# Altium schematic sheet SH04-DSP.SchDoc
size A4
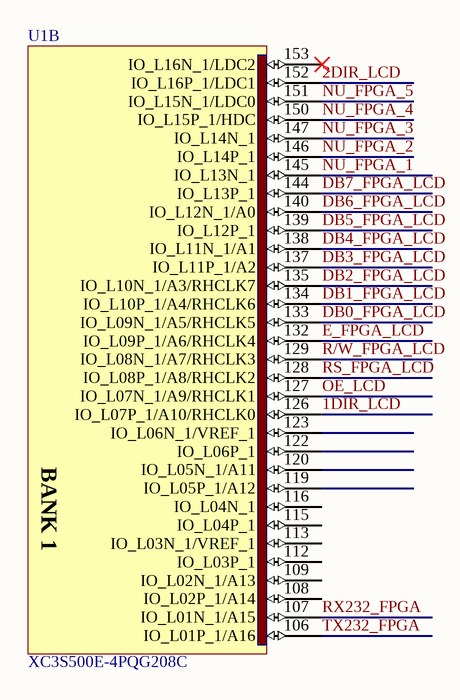
[diagram p0: SH04-DSP.SchDoc]

## Parts
U1  XC3S500E-4PQG208C  [PQG208_N]  (part B of 8)

## Nets
1DIR_LCD: U1.126(IO_L07P_1/A10/RHCLK0)
2DIR_LCD: U1.152(IO_L16P_1/LDC1)
DB0_FPGA_LCD: U1.133(IO_L09N_1/A5/RHCLK5)
DB1_FPGA_LCD: U1.134(IO_L10P_1/A4/RHCLK6)
DB2_FPGA_LCD: U1.135(IO_L10N_1/A3/RHCLK7)
DB3_FPGA_LCD: U1.137(IO_L11P_1/A2)
DB4_FPGA_LCD: U1.138(IO_L11N_1/A1)
DB5_FPGA_LCD: U1.139(IO_L12P_1)
DB6_FPGA_LCD: U1.140(IO_L12N_1/A0)
DB7_FPGA_LCD: U1.144(IO_L13P_1)
E_FPGA_LCD: U1.132(IO_L09P_1/A6/RHCLK4)
NU_FPGA_1: U1.145(IO_L13N_1)
NU_FPGA_2: U1.146(IO_L14P_1)
NU_FPGA_3: U1.147(IO_L14N_1)
NU_FPGA_4: U1.150(IO_L15P_1/HDC)
NU_FPGA_5: U1.151(IO_L15N_1/LDC0)
~{OE}_LCD: U1.127(IO_L07N_1/A9/RHCLK1)
R/W_FPGA_LCD: U1.129(IO_L08N_1/A7/RHCLK3)
RS_FPGA_LCD: U1.128(IO_L08P_1/A8/RHCLK2)
RX232_FPGA: U1.107(IO_L01N_1/A15)
TX232_FPGA: U1.106(IO_L01P_1/A16)

Not connected (* = marked no-connect by the designer): U1 108(IO_L02P_1/A14) 109(IO_L02N_1/A13) 112(IO_L03P_1) 113(IO_L03N_1/VREF_1) 115(IO_L04P_1) 116(IO_L04N_1) 119(IO_L05P_1/A12) 120(IO_L05N_1/A11) 122(IO_L06P_1) 123(IO_L06N_1/VREF_1) 153(IO_L16N_1/LDC2)*

## Notes on the sheet
- (in symbol XC3S500E-4PQG208C, part B) BANK 1

## Library data of the parts
U1 = XC3S500E-4PQG208C: Spartan-3E 1.2V FPGA, 158 User I/Os, 208-Pin Pb-Free PQFP, Standard Performance, Commercial Grade; Published: 6-Jun-2005; LatestRevisionDate: 13-Apr-2006; LatestRevisionNote: IPC-7351 Footprint Added.; DatasheetVersion: 16-Mar-2007; PackageVersion: ver1.2, Jun-2004; PackageReference: PQG208; Publisher: Altium Limited; PackageDescription: 208-Pin Plastic Quad Flat Pack (PQG208) - Pb-Free; Code_JEDEC: MS-029-FA-1; ComponentLink1Description: Manufacturer Link; ComponentLink1URL: http://www.xilinx.com/products/silicon_solutions/fpgas/spartan_series/spartan3e_fpgas/index.htm; ComponentLink2Description: Datasheet; ComponentLink2URL: http://direct.xilinx.com/bvdocs/publications/ds312.pdf